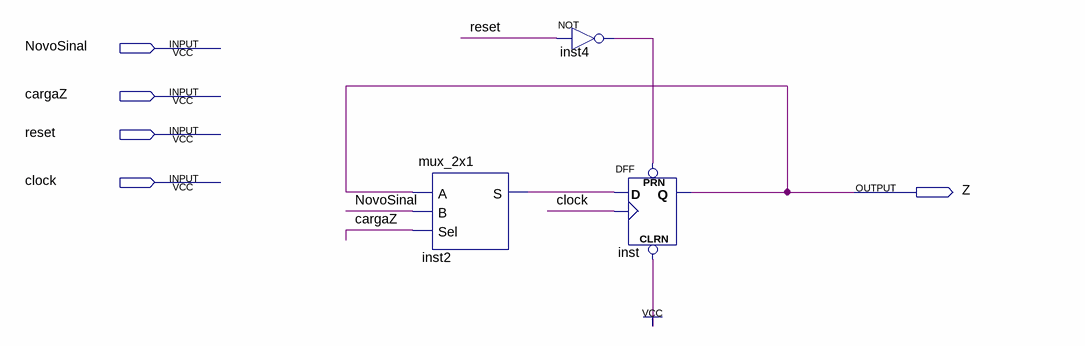
[diagram p0: schematic sheet]
// Quartus schematic registrador_Z.bdf as structural Verilog: 3 symbols, 5 pins
module registrador_Z (
  input  NovoSinal,
  input  cargaZ,
  input  reset,
  input  clock,
  output Z
);

  wire inst2_s, inst4_out;

  mux_2x1 inst2 (.A(Z), .B(NovoSinal), .Sel(cargaZ), .S(inst2_s));
  not inst4 (inst4_out, reset);
  DFF inst (.CLRN(1'b1), .CLK(clock), .D(inst2_s), .PRN(inst4_out), .Q(Z));
endmodule
